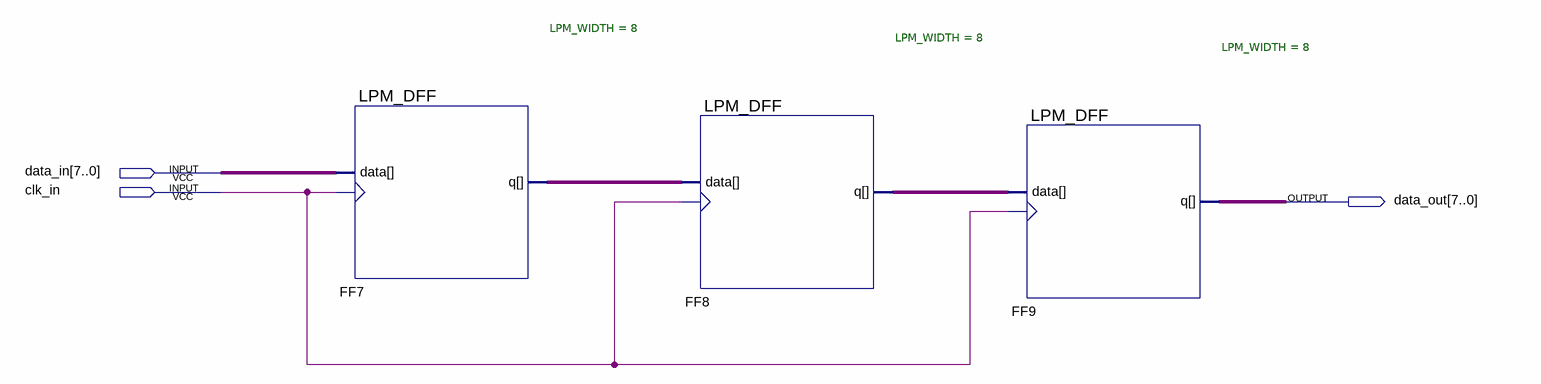
[diagram p0: schematic sheet]
// Quartus schematic triple_dff.bdf as structural Verilog: 3 symbols, 3 pins
module triple_dff (
  input  [7:0] data_in,
  input  clk_in,
  output [7:0] data_out
);

  wire [7:0] FF7_q, FF8_q;

  LPM_DFF #(.LPM_WIDTH(8)) FF7 (.clock(clk_in), .data(data_in), .q(FF7_q));
  LPM_DFF #(.LPM_WIDTH(8)) FF8 (.clock(clk_in), .data(FF7_q), .q(FF8_q));
  LPM_DFF #(.LPM_WIDTH(8)) FF9 (.clock(clk_in), .data(FF8_q), .q(data_out));
endmodule
